# EAGLE design master-v10 (EAGLE 6.5.0)
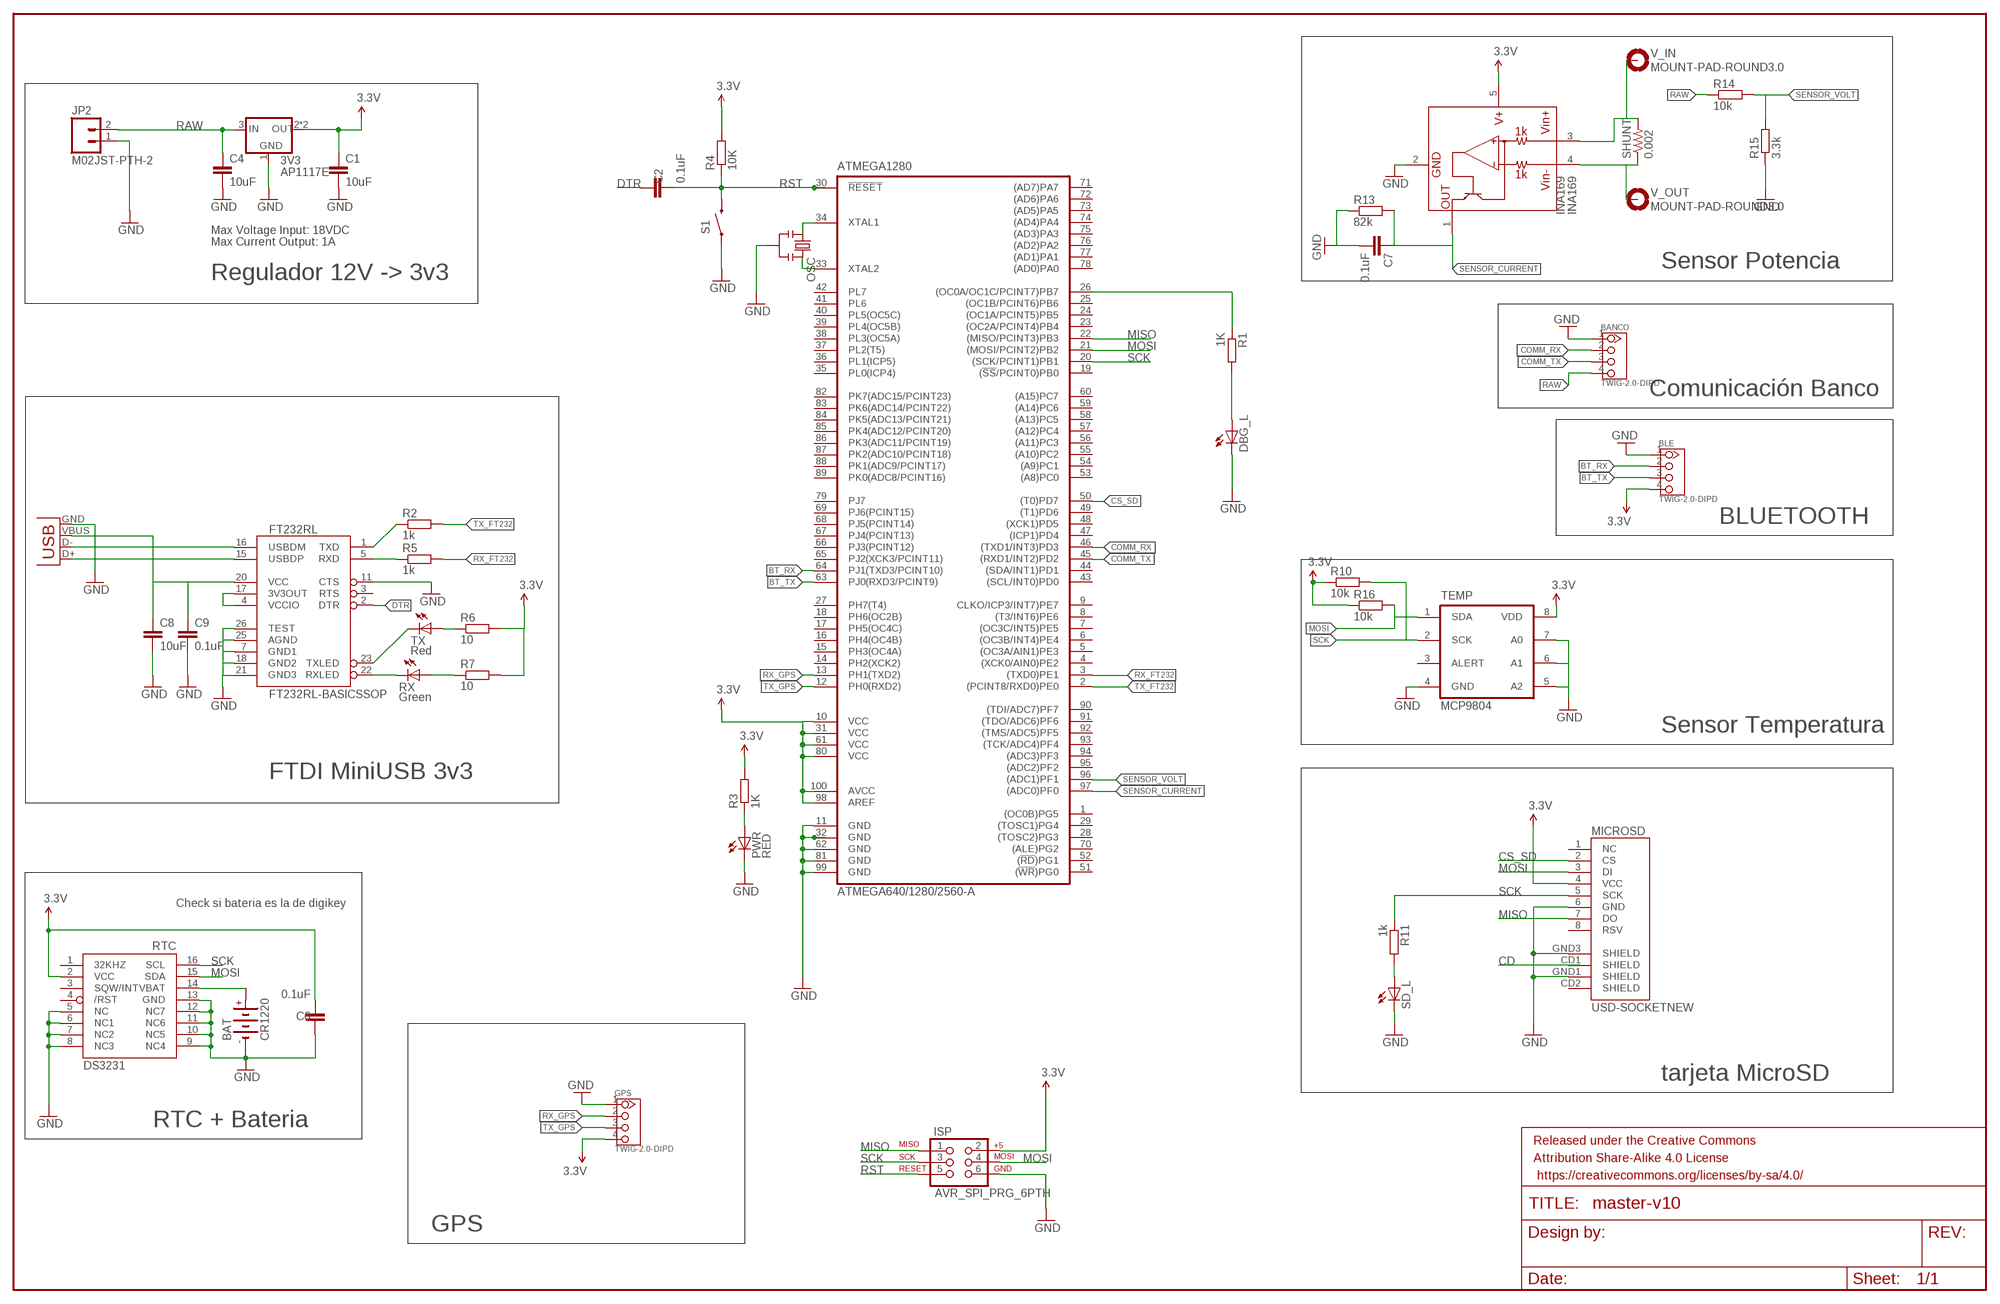
[diagram p0: schematic, sheet 1]

## Parts
3V3  AP1117E  [SOT223]
ATMEGA1280  ATMEGA640/1280/2560-A  [TQFP100A]
BANCO  TWIG-2.0-DIPD  [2.0_1X4_90]
BAT  CR1220  [CR1220]
BLE  TWIG-2.0-DIPD  [2.0_1X4_90]
C1  10uF  C-EUC0805K  [C0805K]
C2  0.1uF  C-EUC0805K  [C0805K]
C4  10uF  C-EUC0805K  [C0805K]
C6  0.1uF  C-EUC0805K  [C0805K]
C7  0.1uF  C-EUC0805K  [C0805K]
C8  10uF  C-EUC1206K  [C1206K]
C9  0.1uF  C-EUC0805K  [C0805K]
DBG_L  LEDCHIPLED_0805  [CHIPLED_0805]
FRAME1  FRAME-LEDGER  [CREATIVE_COMMONS]
FT232RL  FT232RL-BASICSSOP  [SSOP28DB]
GPS  TWIG-2.0-DIPD  [2.0_1X4_90]
INA169  INA169  [SOT23-5]
ISP  AVR_SPI_PRG_6PTH  [2X3]
JP1  USB-MB-H  [USB-MB-H]
JP2  M02JST-PTH-2  [JST-2-PTH]
MICROSD  USD-SOCKETNEW  [MICRO-SD-SOCKET-PP]
OSC  RESONATOR-SMD  [RESONATOR-SMD]
PWR  RED  LEDCHIPLED_0805  [CHIPLED_0805]
R1  1K  R-EU_R0805  [R0805]
R2  1k  R-EU_R0805  [R0805]
R3  1K  R-EU_R0805  [R0805]
R4  10K  R-EU_R0805  [R0805]
R5  1k  R-EU_R0805  [R0805]
R6  10  R-EU_R0805  [R0805]
R7  10  R-EU_R0805  [R0805]
R10  10k  R-EU_R0805  [R0805]
R11  1k  R-EU_R0805  [R0805]
R13  82k  R-EU_R0805  [R0805]
R14  10k  R-EU_R0805  [R0805]
R15  3.3k  R-EU_R0805  [R0805]
R16  10k  R-EU_R0805  [R0805]
RTC  DS3231/SO  [SO16W]
RX  Green  LEDSML0805  [SML0805]
S1  SWITCH-MOMENTARY-2-SMD-1101NE  [TACTILE-SWITCH-1101NE]
SD_L  LEDCHIPLED_0805  [CHIPLED_0805]
SHUNT  0.002  RESISTOR1206  [1206]
TEMP  MCP9804  [MSOP8]
TX  Red  LEDSML0805  [SML0805]
V_IN  MOUNT-PAD-ROUND3.0  [3,0-PAD]
V_OUT  MOUNT-PAD-ROUND3.0  [3,0-PAD]

## Nets
3.3V: 3V3.2(OUT) 3V3.4(OUT) ATMEGA1280.10(VCC) ATMEGA1280.31(VCC) ATMEGA1280.61(VCC) ATMEGA1280.80(VCC) ATMEGA1280.98(AREF) ATMEGA1280.100(AVCC) BLE.4 C1.1 C6.1 GPS.4 INA169.5(V+) ISP.2 MICROSD.4(VCC) R3.2 R4.2 R6.2 R7.2 R10.1 R16.1 RTC.2(VCC) TEMP.8(VDD)
BT_RX: ATMEGA1280.64(PJ1(TXD3/PCINT10)) BLE.2
BT_TX: ATMEGA1280.63(PJ0(RXD3/PCINT9)) BLE.3
COMM_RX: ATMEGA1280.46((TXD1/INT3)PD3) BANCO.2
COMM_TX: ATMEGA1280.45((RXD1/INT2)PD2) BANCO.3
CS_SD: ATMEGA1280.50((T0)PD7) MICROSD.2(CS)
DTR: C2.2 FT232RL.2(DTR)
GND [vcc]: 3V3.1(GND) ATMEGA1280.11(GND) ATMEGA1280.32(GND) ATMEGA1280.62(GND) ATMEGA1280.81(GND) ATMEGA1280.99(GND) BANCO.1 BAT.- BLE.1 C1.2 C4.2 C6.2 C7.2 C8.2 C9.2 DBG_L.C FT232RL.7(GND1) FT232RL.11(CTS) FT232RL.18(GND2) FT232RL.21(GND3) FT232RL.25(AGND) FT232RL.26(TEST) GPS.1 INA169.2(GND) ISP.6 JP1.GND JP2.1 MICROSD.6(GND) MICROSD.GND1(SHIELD) MICROSD.GND3(SHIELD) OSC.2 PWR.C R13.1 R15.1 RTC.5(NC) RTC.6(NC1) RTC.7(NC2) RTC.8(NC3) RTC.9(NC4) RTC.10(NC5) RTC.11(NC6) RTC.12(NC7) RTC.13(GND) S1.P$1 SD_L.C TEMP.4(GND) TEMP.5(A2) TEMP.6(A1) TEMP.7(A0)
MISO: ATMEGA1280.22((MISO/PCINT3)PB3) ISP.1 MICROSD.7(DO)
MOSI: ATMEGA1280.21((MOSI/PCINT2)PB2) ISP.4 MICROSD.3(DI) R16.2 RTC.15(SDA) TEMP.1(SDA)
N$1: BAT.+ RTC.14(VBAT)
N$2: ATMEGA1280.34(XTAL1) OSC.1
N$3: DBG_L.A R1.2
N$4: ATMEGA1280.26((OC0A/OC1C/PCINT7)PB7) R1.1
N$5: FT232RL.15(USBDP) JP1.D+
N$6: FT232RL.1(TXD) R2.1
N$7: PWR.A R3.1
N$8: FT232RL.5(RXD) R5.1
N$10: FT232RL.22(RXLED) RX.C
N$11: R7.1 RX.A
N$12: FT232RL.23(TXLED) TX.C
N$13: R6.1 TX.A
N$14: ATMEGA1280.33(XTAL2) OSC.3
N$19: FT232RL.16(USBDM) JP1.D-
N$23: R11.2 SD_L.A
N$24: C8.1 C9.1 FT232RL.20(VCC) JP1.VBUS
N$25: FT232RL.4(VCCIO) FT232RL.17(3V3OUT)
RAW [vcc]: 3V3.3(IN) BANCO.4 C4.1 JP2.2 R14.1
RST: ATMEGA1280.30(!RESET!) C2.1 ISP.5 R4.1 S1.P$2
RX_FT232: ATMEGA1280.3((TXD0)PE1) R5.2
RX_GPS: ATMEGA1280.13(PH1(TXD2)) GPS.2
SCK: ATMEGA1280.20((SCK/PCINT1)PB1) ISP.3 MICROSD.5(SCK) R10.2 R11.1 RTC.16(SCL) TEMP.2(SCK)
SENSOR_CURRENT: ATMEGA1280.97((ADC0)PF0) C7.1 INA169.1(OUT) R13.2
SENSOR_VOLT: ATMEGA1280.96((ADC1)PF1) R14.2 R15.2
TX_FT232: ATMEGA1280.2((PCINT8/RXD0)PE0) R2.2
TX_GPS: ATMEGA1280.12(PH0(RXD2)) GPS.3
VIN+: INA169.3(VIN+) SHUNT.2 V_IN.B3,0(MOUNT)
VIN-: INA169.4(VIN-) SHUNT.1 V_OUT.B3,0(MOUNT)
Unconnected: ATMEGA1280.1((OC0B)PG5) ATMEGA1280.4((XCK0/AIN0)PE2) ATMEGA1280.5((OC3A/AIN1)PE3) ATMEGA1280.6((OC3B/INT4)PE4) ATMEGA1280.7((OC3C/INT5)PE5) ATMEGA1280.8((T3/INT6)PE6) ATMEGA1280.9(CLKO/ICP3/INT7)PE7) ATMEGA1280.14(PH2(XCK2)) ATMEGA1280.15(PH3(OC4A)) ATMEGA1280.16(PH4(OC4B)) ATMEGA1280.17(PH5(OC4C)) ATMEGA1280.18(PH6(OC2B)) ATMEGA1280.19((!SS!/PCINT0)PB0) ATMEGA1280.23((OC2A/PCINT4)PB4) ATMEGA1280.24((OC1A/PCINT5)PB5) ATMEGA1280.25((OC1B/PCINT6)PB6) ATMEGA1280.27(PH7(T4)) ATMEGA1280.28((TOSC2)PG3) ATMEGA1280.29((TOSC1)PG4) ATMEGA1280.35(PL0(ICP4)) ATMEGA1280.36(PL1(ICP5)) ATMEGA1280.37(PL2(T5)) ATMEGA1280.38(PL3(OC5A)) ATMEGA1280.39(PL4(OC5B)) ATMEGA1280.40(PL5(OC5C)) ATMEGA1280.41(PL6) ATMEGA1280.42(PL7) ATMEGA1280.43((SCL/INT0)PD0) ATMEGA1280.44((SDA/INT1)PD1) ATMEGA1280.47((ICP1)PD4) ATMEGA1280.48((XCK1)PD5) ATMEGA1280.49((T1)PD6) ATMEGA1280.51((!WR!)PG0) ATMEGA1280.52((!RD!)PG1) ATMEGA1280.53((A8)PC0) ATMEGA1280.54((A9)PC1) ATMEGA1280.55((A10)PC2) ATMEGA1280.56((A11)PC3) ATMEGA1280.57((A12)PC4) ATMEGA1280.58((A13)PC5) ATMEGA1280.59((A14)PC6) ATMEGA1280.60((A15)PC7) ATMEGA1280.65(PJ2(XCK3/PCINT11)) ATMEGA1280.66(PJ3(PCINT12)) ATMEGA1280.67(PJ4(PCINT13)) ATMEGA1280.68(PJ5(PCINT14)) ATMEGA1280.69(PJ6(PCINT15)) ATMEGA1280.70((ALE)PG2) ATMEGA1280.71((AD7)PA7) ATMEGA1280.72((AD6)PA6) ATMEGA1280.73((AD5)PA5) ATMEGA1280.74((AD4)PA4) ATMEGA1280.75((AD3)PA3) ATMEGA1280.76((AD2)PA2) ATMEGA1280.77((AD1)PA1) ATMEGA1280.78((AD0)PA0) ATMEGA1280.79(PJ7) ATMEGA1280.82(PK7(ADC15/PCINT23)) ATMEGA1280.83(PK6(ADC14/PCINT22)) ATMEGA1280.84(PK5(ADC13/PCINT21)) ATMEGA1280.85(PK4(ADC12/PCINT20)) ATMEGA1280.86(PK3(ADC11/PCINT19)) ATMEGA1280.87(PK2(ADC10/PCINT18)) ATMEGA1280.88(PK1(ADC9/PCINT17)) ATMEGA1280.89(PK0(ADC8/PCINT16)) ATMEGA1280.90((TDI/ADC7)PF7) ATMEGA1280.91((TDO/ADC6)PF6) ATMEGA1280.92((TMS/ADC5)PF5) ATMEGA1280.93((TCK/ADC4)PF4) ATMEGA1280.94((ADC3)PF3) ATMEGA1280.95((ADC2)PF2) FT232RL.3(RTS) MICROSD.1(NC) MICROSD.8(RSV) MICROSD.CD1(SHIELD) MICROSD.CD2(SHIELD) RTC.1(32KHZ) RTC.3(SQW/INT) RTC.4(/RST) TEMP.3(ALERT)

## Notes on the sheet
- Max Voltage Input: 18VDC
- Max Current Output: 1A
- Sensor Potencia
- Regulador 12V -> 3v3
- Comunicación Banco
- BLUETOOTH
- Sensor Temperatura
- FTDI MiniUSB 3v3
- Check si bateria es la de digikey
- tarjeta MicroSD
- RTC + Bateria
- GPS

## Library data of the parts
3V3 = v-reg:AP1117: LDO Regulator
ATMEGA1280 = atmel-avr:ATMEGA640/1280/2560: MICROCONTROLLER 64K/128K/256K Flash 8K Bytes Internal SRAM 4K Bytes EEPROM
BANCO BLE GPS = Grove :TWIG-2.0-DIP
BAT = battery:CR1220: LI BATTERY Panasonic
C1 C2 C4 C6-C9 = rcl:C-EU: CAPACITOR, European symbol
DBG_L PWR SD_L = adafruit:LED: LED
FRAME1 = SparkFun-Aesthetics:FRAME-LEDGER: Schematic Frame Standard 11x14 US Ledger frame
FT232RL = SparkFun-DigitalIC:FT232RL-BASIC: USB UART This is the simplified version of the FT232RL unit. Only what you need, nothing you don't. Spark Fun Electronics SKU : COM-00650
INA169 = SparkFun-AnalogIC:INA169
ISP = SparkFun-Connectors:AVR_SPI_PRG_6: AVR ISP 6 Pin This is the reduced ISP connector for AVR programming. Common on Arduino. This footprint will take up less PCB space and can be used with a 10-pin to 6-pin adapter such as SKU: BOB-08508
JP1 = SparkFun-Connectors:USB: USB Connectors USB-B-PTH is fully proven SKU : PRT-00139/CONN-08278 USB-miniB is fully proven SKU : PRT-00587 USB-A-PCB is untested. USB-A-H is throughly reviewed, but untested. Spark Fun Electronics SKU : PRT-00437 USB-B-SMT is throughly reviewed, but untested. Needs silkscreen touching up. USB-A-S has not been used/tested USB-MB-H has not been used/tested USB-MICROB has been used. CONN-09505
JP2 = SparkFun-Connectors:M02: Standard 2-pin 0.1" header. Use with - straight break away headers ( PRT-00116) - right angle break away headers (PRT-00553) - swiss pins (PRT-00743) - machine pins (PRT-00117) - female headers (PRT-00115) Molex polarized connector foot print use with: PRT-08233 with associated crimp pins and housings. 2.54_SCREWTERM for use with PRT-10571. 3.5mm Screw Terminal footprints for PRT-08084 5mm Screw Terminal footprints for use with PRT-08433; SKU: PRT-09914
MICROSD = SparkFun-Connectors:USD-SOCKET: microSD Socket Push-push type uSD socket. Schematic element and footprint production proven. Spark Fun Electronics SKU : PRT-00127. tDoc lines correctly indicate media card edge positions when inserting (unlocked, locked, depressed).
OSC = resonador:RESONATOR-: Resonator Small SMD resonator. This is the itty bitty 10/20MHz resonators with built in caps. CSTCE10M0G55 and CSTCE20M0V53. Footprint has been reviewed closely but hasn't been tested yet.
R1-R7 R10 R11 R13-R16 = rcl:R-EU_: RESISTOR, European symbol
RTC = adafruit:DS3231
RX TX = led:LED: LED
S1 = SparkFun-Electromechanical:SWITCH-MOMENTARY-2: Various NO switches- pushbuttons, reed, etc
SHUNT = SparkFun-Resistors:RESISTOR: Resistor Basic schematic elements and footprints for 0603, 1206, and PTH resistors.
TEMP = MCP9804:MCP9804: TEMP SENSOR
V_IN V_OUT = holes:MOUNT-PAD-ROUND: MOUNTING PAD, round

## Net classes
0 default: width 0.178 mm
1 vcc: width 0.203 mm

## Board
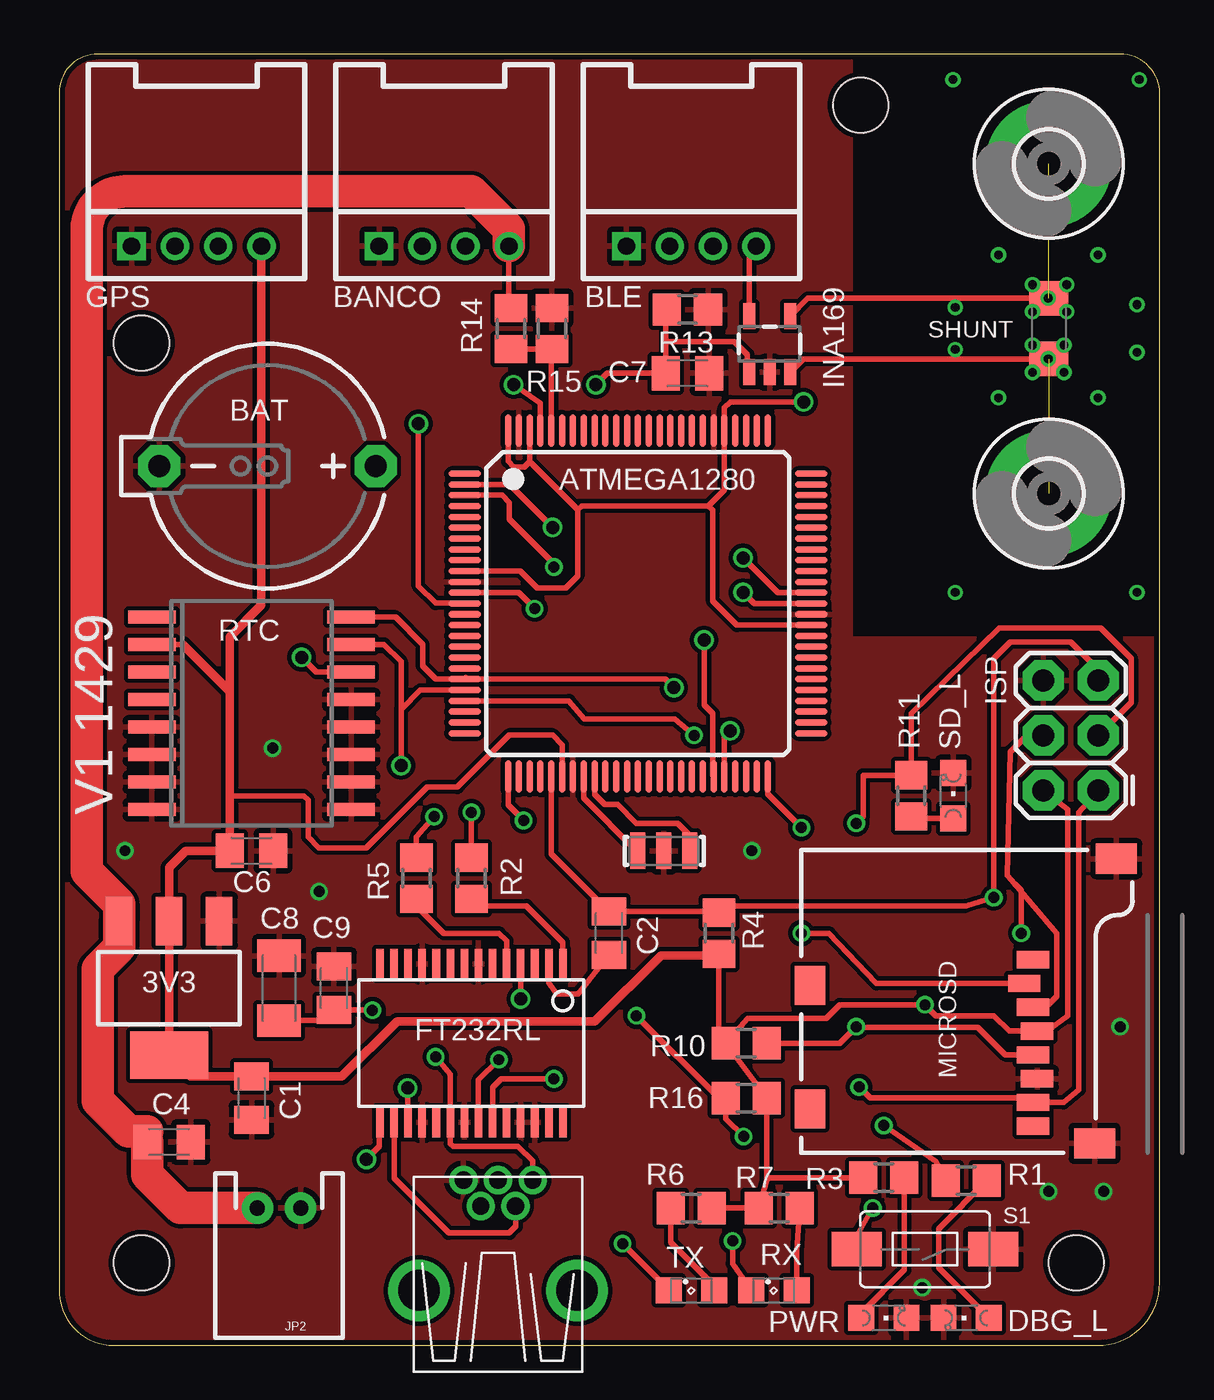
[diagram p1: board, top side]
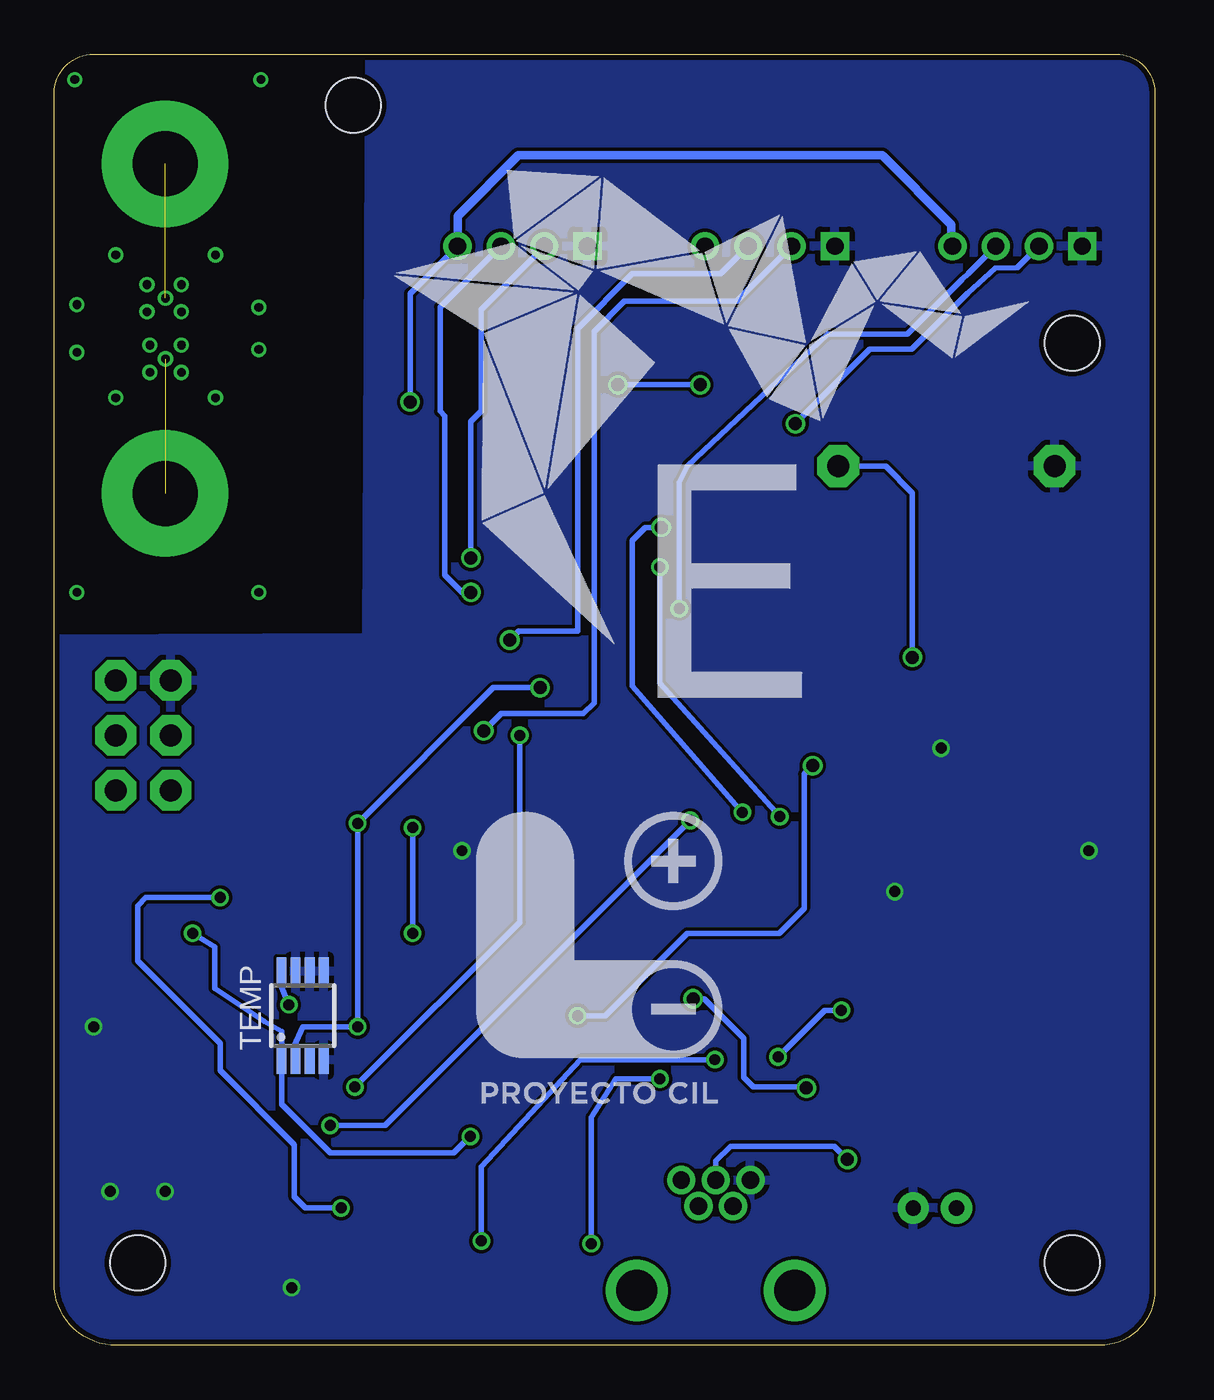
[diagram p2: board, bottom side, seen from below]

Size 50.85 x 59.68 mm. Coordinates in mm from the lower left corner, seen from the top.
Outline: 2.54,0 47.97,0 arc90 50.85,2.89 50.85,57.85 arc90 49.02,59.68 1.79,59.68 arc90 0,57.89 0,2.54 arc90 2.54,0
Copper layers (1*16): Top 0.035mm / dielectric 1.5mm / Bottom 0.035mm
Design rules "ITEADstudio_DRC": minimum track width 6mil, minimum drill 12mil, track to track 6mil, track to pad 6mil, pad to pad 6mil, via to via 6mil, smd to smd 0mil, copper to edge 10mil, drill to drill 10mil, minimum pad ring 10mil, minimum via ring 6mil, stop-mask expansion 2mil, vias tented up to drill 100mil, thermal gap 10mil
Holes 2.54 mm at 3.81,46.32 46.99,3.81 37.03,57.32 3.81,3.81

### Footprints (pad centres in the part's own frame; a part is rotated, then mirrored left to right if it is on the bottom)
SOT223 = smd 1.219 x 2.235: 1 -2.311,-3.099; 2 0,-3.099; 3 2.311,-3.099 | smd 3.6 x 2.2: 4 0,3.099
TQFP100A = smd 1.5 x 0.3: 1 -8,6; 2 -8,5.5; 3 -8,5; 4 -8,4.5; 5 -8,4; 6 -8,3.5; 7 -8,3; 8 -8,2.5; 9 -8,2; 10 -8,1.5; 11 -8,1; 12 -8,0.5; 13 -8,0; 14 -8,-0.5; 15 -8,-1; 16 -8,-1.5; 17 -8,-2; 18 -8,-2.5; 19 -8,-3; 20 -8,-3.5; 21 -8,-4; 22 -8,-4.5; 23 -8,-5; 24 -8,-5.5; 25 -8,-6; 51 8,-6; 52 8,-5.5; 53 8,-5; 54 8,-4.5; 55 8,-4; 56 8,-3.5; 57 8,-3; 58 8,-2.5; 59 8,-2; 60 8,-1.5; 61 8,-1; 62 8,-0.5; 63 8,0; 64 8,0.5; 65 8,1; 66 8,1.5; 67 8,2; 68 8,2.5; 69 8,3; 70 8,3.5; 71 8,4; 72 8,4.5; 73 8,5; 74 8,5.5; 75 8,6 | smd 0.3 x 1.5: 26 -6,-8; 27 -5.5,-8; 28 -5,-8; 29 -4.5,-8; 30 -4,-8; 31 -3.5,-8; 32 -3,-8; 33 -2.5,-8; 34 -2,-8; 35 -1.5,-8; 36 -1,-8; 37 -0.5,-8; 38 0,-8; 39 0.5,-8; 40 1,-8; 41 1.5,-8; 42 2,-8; 43 2.5,-8; 44 3,-8; 45 3.5,-8; 46 4,-8; 47 4.5,-8; 48 5,-8; 49 5.5,-8; 50 6,-8; 76 6,8; 77 5.5,8; 78 5,8; 79 4.5,8; 80 4,8; 81 3.5,8; 82 3,8; 83 2.5,8; 84 2,8; 85 1.5,8; 86 1,8; 87 0.5,8; 88 0,8; 89 -0.5,8; 90 -1,8; 91 -1.5,8; 92 -2,8; 93 -2.5,8; 94 -3,8; 95 -3.5,8; 96 -4,8; 97 -4.5,8; 98 -5,8; 99 -5.5,8; 100 -6,8
2.0_1X4_90 = drill 0.8 pad 1.27 square: 1 -3,0 | drill 0.8 pad 1.27: 2 -1,0; 3 1,0; 4 3,0
CR1220 = drill 1.016 pad 1.93 octagon: + -5,0; - 5,0
C0805K = smd 1.3 x 1.6: 1 -1,0; 2 1,0
C1206K = smd 1.5 x 2: 1 -1.5,0; 2 1.5,0
CHIPLED_0805 = smd 1.2 x 1.2: A 0,-1.05; C 0,1.05
SSOP28DB = smd 0.348 x 1.397: 1 -4.225,-3.656; 2 -3.575,-3.656; 3 -2.925,-3.656; 4 -2.275,-3.656; 5 -1.625,-3.656; 6 -0.975,-3.656; 7 -0.325,-3.656; 8 0.325,-3.656; 9 0.975,-3.656; 10 1.625,-3.656; 11 2.275,-3.656; 12 2.925,-3.656; 13 3.575,-3.656; 14 4.225,-3.656; 15 4.225,3.656; 16 3.575,3.656; 17 2.925,3.656; 18 2.275,3.656; 19 1.625,3.656; 20 0.975,3.656; 21 0.325,3.656; 22 -0.325,3.656; 23 -0.975,3.656; 24 -1.625,3.656; 25 -2.275,3.656; 26 -2.925,3.656; 27 -3.575,3.656; 28 -4.225,3.656
SOT23-5 = smd 0.55 x 1.2: 1 -0.95,-1.3; 2 0,-1.3; 3 0.95,-1.3; 4 0.95,1.3; 5 -0.95,1.3
2X3 = drill 1.016 pad 1.88 octagon: 1 0,0; 2 0,2.54; 3 2.54,0; 4 2.54,2.54; 5 5.08,0; 6 5.08,2.54
USB-MB-H = drill 0.8: D+ 5.1,0; D- 3.9,0.8; GND 5.1,-1.6; ID 3.9,-0.8; VBUS 5.1,1.6 | drill 1.9: P$6 0,-3.65; P$7 0,3.65
JST-2-PTH = drill 0.7 pad 1.448: 1 -1,0; 2 1,0
MICRO-SD-SOCKET-PP = smd 0.8 x 1.5: 1 -8.94,10.7; 2 -7.84,10.3; 3 -6.74,10.7; 4 -5.64,10.9; 5 -4.54,10.7; 6 -3.44,10.9; 7 -2.34,10.7; 8 -1.24,10.7 | smd 1.8 x 1.4: CD1 -2.05,0.4; CD2 -7.75,0.4 | smd 1.4 x 1.9: GND1 -13.6,14.55; GND3 -0.45,13.55
RESONATOR-SMD = smd 0.7 x 1.7: 1 -1.2,0; 2 0,0; 3 1.2,0
R0805 = smd 1.3 x 1.5: 1 -0.95,0; 2 0.95,0
SO16W = smd 0.6 x 2.2: 1 -4.445,-4.6; 2 -3.175,-4.6; 3 -1.905,-4.6; 4 -0.635,-4.6; 5 0.635,-4.6; 6 1.905,-4.6; 7 3.175,-4.6; 8 4.445,-4.6; 9 4.445,4.6; 10 3.175,4.6; 11 1.905,4.6; 12 0.635,4.6; 13 -0.635,4.6; 14 -1.905,4.6; 15 -3.175,4.6; 16 -4.445,4.6
SML0805 = smd 1.2 x 1.2: A 1.05,0; C -1.05,0
TACTILE-SWITCH-1101NE = smd 2.3 x 1.6: P$1 -3.15,0; P$2 3.15,0
1206 = smd 1.6 x 1.8: 1 -1.4,0; 2 1.4,0
MSOP8 = smd 0.45 x 1.3: 1 -0.975,-2.05; 2 -0.325,-2.05; 3 0.325,-2.05; 4 0.975,-2.05; 5 0.975,2.05; 6 0.325,2.05; 7 -0.325,2.05; 8 -0.975,2.05
3,0-PAD = drill 3 pad 5.842: B3,0 0,0

### Placement (x,y rotation side)
3V3  5.08,16.51 180 top
ATMEGA1280  26.74,34.29 0 top
BANCO  17.78,50.8 0 top
BAT  9.63,40.64 180 top
BLE  29.21,50.8 0 top
C1  8.89,11.43 270 top
C2  25.4,19.05 270 top
C4  5.08,9.4 0 top
C6  8.89,22.86 0 top
C7  29.03,44.93 0 top
C8  10.16,16.51 90 top
C9  12.7,16.51 90 top
DBG_L  41.91,1.27 90 top
FRAME1  7.62,-12.7 0 top  (outside the outline)
FT232RL  19.05,13.97 180 top
GPS  6.35,50.8 0 top
INA169  32.83,46.28 0 top
ISP  48.01,25.65 90 top
JP1  20.28,2.54 90 bottom
JP2  10.16,6.35 180 top
MICROSD  34.29,8.89 270 top
OSC  27.94,22.86 180 top
PWR  38.1,1.27 270 top
R1  41.91,7.62 0 top
R2  19.05,21.59 90 top
R3  38.1,7.75 180 top
R4  30.48,19.05 270 top
R5  16.51,21.59 90 top
R6  29.21,6.35 0 top
R7  33.27,6.35 180 top
R10  31.75,13.97 0 top
R11  39.37,25.4 270 top
R13  29.03,47.87 180 top
R14  20.88,46.99 270 top
R15  22.76,46.99 270 top
R16  31.75,11.43 180 top
RTC  8.89,29.21 270 top
RX  33.02,2.54 0 top
S1  40.01,4.45 180 top
SD_L  41.31,25.4 0 top
SHUNT  45.72,46.99 270 top
TEMP  39.37,15.24 0 bottom
TX  29.21,2.54 0 top
U$1  [LOGO_CIL]  33.27,10.29 0 bottom
U$2  [LOGO_ELIBATT]  35.56,26.67 0 bottom
V_IN  45.72,39.37 0 top
V_OUT  45.72,54.61 0 top

### Tracks (layer width: path | path; a pad name or v marks a point on that pad's centre or on a via)
3.3V  (via drill 0.51, 0.6)
  Top 0.254: 6.06,12.43 3V3.4 | R6.2 R7.2 32.7,7.62 | 32.7,7.62 R16.1 R10.1 | 5.08,20.05 3V3.2 | ISP.2 46.61,24.77 46.61,15.24 45.65,14.53 MICROSD.4 43.89,14.53 43.18,15.24 40.51,15.24 v40.01,15.75 | 39.95,15.8 v40.01,15.75 | R10.1 31.82,15.11 35.43,15.11 36.07,15.75 v40.01,15.75 | R10.1 30.48,14.67 30.48,17.65 30.54,18.1 R4.2 30.41,18.03 | ATMEGA1280.10 21.31,35.79 22.1,35 23.4,35 23.96,35.56 23.96,38.62 | 5.71,32.38 RTC.2 | ATMEGA1280.100 20.74,40.86 21,40.6 21.5,40.6 21.74,40.84 | 21.74,40.84 ATMEGA1280.98 | 21.74,40.84 23.96,38.62 | BLE.4 31.88,50.47 INA169.5 | v34.4,43.6 31,43.6 30.74,43.34 ATMEGA1280.80 30.74,39.54 30,38.8 | 30,38.8 24.14,38.8 23.96,38.62 | ATMEGA1280.61 31.31,33.29 30.2,34.4 30.2,38.6 30,38.8 | ATMEGA1280.31 23.24,27.76 22.8,28.2 20.8,28.2 18.4,25.8 17,25.8 14.2,23 12,23 11.5,23.5 11.5,25.2 11.3,25.4 7.89,25.4 | R3.2 32.83,7.75 32.7,7.62
  Top 0.4: 6.06,12.43 C1.1 13.06,12.43 15.62,14.99 24.18,14.97 24.75,14.97 27.81,18.03 30.41,18.03 | 7.89,30.21 7.89,25.4 C6.1 5.84,22.86 5.08,22.1 3V3.2 3V3.4 | 7.89,30.21 5.71,32.38 | 7.89,30.21 7.89,32.75 9.35,34.21 GPS.4
  Bottom 0.254: v40.01,15.75 40.34,16.55 TEMP.8 | v34.4,43.6 34.4,48.61 BLE.4
  Bottom 0.4: GPS.4 9.4,50.85 9.4,51.8 12.6,55 29.4,55 32.21,52.19 BLE.4
BT_RX  (via drill 0.6)
  Top 0.254: 34.54,34.79 ATMEGA1280.64 33.21,34.79 v31.6,36.4
  Bottom 0.254: BLE.2 28.21,50.78 31.11,47.88 31.11,43.18 31.6,42.7 v31.6,36.4
BT_TX  (via drill 0.6)
  Top 0.254: v31.6,34.8 32.11,34.29 ATMEGA1280.63
  Bottom 0.254: BLE.3 33.02,47.99 33.02,43.18 32.8,42.96 32.8,35.6 32,34.8 v31.6,34.8
COMM_RX  (via drill 0.6)
  Top 0.254: v31,28.4 30.74,28.14 ATMEGA1280.46
  Bottom 0.254: BANCO.2 19.32,48.26 24.51,48.26 25.91,46.86 25.91,29.69 26.4,29.2 30.2,29.2 v31,28.4
COMM_TX  (via drill 0.6)
  Top 0.254: v29.8,32.6 29.8,29.6 30.2,29.2 30.2,26.33 ATMEGA1280.45
  Bottom 0.254: BANCO.3 20.05,49.53 24.13,49.53 26.67,46.99 26.67,33.02 29.38,33.02 v29.8,32.6
CS_SD  (via drill 0.51)
  Top 0.254: MICROSD.2 37.75,16.73 35.56,19.05 v34.29,19.05 | v34.29,23.93 32.74,25.48 ATMEGA1280.50
  Bottom 0.254: v34.29,19.05 v34.29,23.93
DTR
  Top 0.254: FT232RL.2 22.62,16.75 22.99,16.26 23.99,16.26 C2.2
GND  (via drill 0.5, 0.51)
  other vias: 9.87,27.6 3.05,22.86 12.01,20.97 32,22.86 39.88,2.67 45.72,7.11 48.26,7.11 49.02,14.73
  pour Bottom: 48.41,0.25 2.95,-0.14 arc-90 -0.13,2.91 -0.13,57.34 arc-90 2.35,59.7 36.3,59.51 36.42,32.71 50.8,32.64 50.67,1.88 arc-90
  pour Top (isolate 0.2): 50.8,32.64 50.8,1.8 arc-90 49,0 2.54,0 arc-90 0,2.54 0,57.59 arc-90 2.1,59.69 36.55,59.69 36.55,32.64
MISO  (via drill 0.51)
  Top 0.254: ISP.1 47.12,24.64 47.12,11.81 46.41,11.23 45.72,11.23 | 45.72,11.23 MICROSD.7 | 45.72,11.23 45.52,11.43 37.47,11.43 v36.96,11.94 | ATMEGA1280.22 23.55,29.79 24.26,28.96 28.45,28.96 v29.34,28.19
  Bottom 0.254: v36.96,11.94 29.34,19.56 v29.34,28.19
MOSI  (via drill 0.51, 0.6)
  Top 0.254: ATMEGA1280.21 19.05,30.29 | ATMEGA1280.21 | ISP.4 44.7,28.19 43.94,27.43 43.81,21.72 44.15,21.33 | 44.15,21.33 46.1,19.05 46.1,16.13 45.71,15.76 MICROSD.3 | v31.62,9.65 30.8,10.47 R16.2 30.48,11.43 v26.67,15.24 | v44.45,19.05 44.45,21.03 44.15,21.33 | v15.8,26.8 15.8,29.4 | 15.8,29.4 16.69,30.29 ATMEGA1280.21 | RTC.15 13.51,32.4 15,32.4 15.8,31.6 15.8,29.4
  Bottom 0.254: v31.62,9.65 32.38,8.89 38.1,8.89 40.34,11.13 TEMP.1 40.34,14.52 41.15,14.99 43.43,16.51 43.43,18.41 v44.45,19.05 | v26.67,15.24 25.4,15.24 21.59,19.05 17.35,19.05 16.2,20.2 16.2,26.4 v15.8,26.8
N$1  (via drill 0.6)
  Top 0.254: v11.2,31.8 11.88,31.11 RTC.14
  Bottom 0.254: BAT.+ 12.44,40.64 11.2,39.4 v11.2,31.8
N$2
  Top 0.254: OSC.1 29.14,23.57 28.57,24.13 26.67,24.13 25.8,25 25.2,25 24.74,25.46 ATMEGA1280.34
N$3
  Top 0.254: R1.2 40.64,5.4 40.64,3.59 DBG_L.A
N$4  (via drill 0.51)
  Top 0.254: R1.1 40.77,8.07 40.51,8.51 v38.1,10.16 | ATMEGA1280.26 20.74,24.98 v21.46,24.26
  Bottom 0.254: v21.46,24.26 35.56,10.16 v38.1,10.16
N$5  (via drill 0.6)
  Top 0.254: FT232RL.15 14.8,10.29 14.8,9.2 v14.2,8.6
  Bottom 0.254: v14.2,8.6 14.8,9.2 19.6,9.2 20.28,8.52 JP1.D+
N$6
  Top 0.254: R2.1 19.05,20.32 21.59,20.32 23.27,18.64 FT232RL.1
N$7
  Top 0.254: R3.1 39.05,3.49 37.05,1.49 PWR.A
N$8
  Top 0.254: FT232RL.5 20.68,18.7 20.32,19.05 17.78,19.05 16.51,20.32 R5.1
N$10  (via drill 0.51)
  Top 0.254: FT232RL.22 19.38,12.26 v20.32,13.21 | v31.11,4.83 31.11,3.78 RX.C
  Bottom 0.254: v20.32,13.21 26.54,13.21 31.11,8.26 v31.11,4.83
N$11
  Top 0.254: R7.1 34.07,4.35 RX.A
N$12  (via drill 0.51)
  Top 0.254: FT232RL.23 20.02,11.93 20.42,12.32 v22.86,12.32 | v26.04,4.7 27.94,2.79 27.94,2.76 TX.C
  Bottom 0.254: v22.86,12.32 24.89,12.32 26.04,10.54 v26.04,4.7
N$13
  Top 0.254: R6.1 28.26,4.76 30.26,2.76 TX.A
N$14
  Top 0.254: OSC.3 26.67,22.86 24.24,25.29 ATMEGA1280.33
N$15  (via drill 0.4 pad 0.3)
  other vias: 44.97,49.03
N$16  (via drill 0.4)
  other vias: 46.55,49.03
N$17  (via drill 0.4)
  other vias: 44.97,47.77
N$18  (via drill 0.4)
  other vias: 46.55,47.77
N$19
  Top 0.254: JP1.D- 21.1,6.42 21.1,5.5 20.8,5.2 18,5.2 15.47,7.72 FT232RL.16
N$20  (via drill 0.4)
  other vias: 45.7,48.4
N$21  (via drill 0.4)
  other vias: 44.97,44.97
N$22  (via drill 0.4)
  other vias: 46.43,44.97
N$23
  Top 0.254: SD_L.A 39.47,24.35 R11.2
N$24  (via drill 0.51)
  Top 0.254: 13.35,15.88 C9.1 | C9.1 12.2,15.01 C8.1 | v17.4,13.34 18.07,12.53 FT232RL.20 18.07,9.32 18.2,9.2 21.2,9.2 21.88,8.52 JP1.VBUS | v14.48,15.49 14.46,15.51 C9.1
  Bottom 0.254: v14.48,15.49 15.24,15.49 v17.4,13.34
N$25  (via drill 0.6)
  Top 0.254: FT232RL.17 16.1,10.34 v16.1,11.9 | v21.32,16.01 FT232RL.4
  Bottom 0.254: v16.1,11.9 16.14,11.94 18.54,11.94 19,12.4 19,14.2 20.81,16.01 v21.32,16.01
N$26  (via drill 0.4)
  other vias: 44.97,46.23
N$27  (via drill 0.4)
  other vias: 46.43,46.23
N$28  (via drill 0.4)
  other vias: 45.7,45.6
N$29  (via drill 0.4)
  other vias: 43.4,50.4
N$30  (via drill 0.4)
  other vias: 48,50.4
N$31  (via drill 0.4)
  other vias: 43.4,43.8
N$32  (via drill 0.4)
  other vias: 48,43.8
N$33  (via drill 0.4)
  other vias: 41.4,34.8
N$34  (via drill 0.4)
  other vias: 49.8,34.8
N$35  (via drill 0.4)
  other vias: 41.3,58.5
N$36  (via drill 0.4)
  other vias: 49.9,58.5
N$37  (via drill 0.4)
  other vias: 49.8,48.1
N$38  (via drill 0.4)
  other vias: 41.4,47.97
N$39  (via drill 0.4)
  other vias: 49.8,45.9
N$40  (via drill 0.4)
  other vias: 41.4,46.03
RAW
  Top 0.254: C4.1 4.08,9.89 | 2.54,19.38 3V3.3 | BANCO.4 20.78,48.04 R14.1
  Top 1.5: JP2.2 5.6,6.35 4.08,7.87 C4.1 | BANCO.4 20.78,51.61 19.05,53.34 3.07,53.34 arc90 1.27,51.54 1.27,21.91 2.77,20.41 2.77,20.2 3V3.3 2.77,18.39 1.78,17.4 1.78,11.3 3.19,9.89 4.08,9.89
RST  (via drill 0.51)
  Top 0.254: ISP.5 48.01,31.24 46.74,32.51 43.94,32.51 43.18,31.75 v43.18,20.7 41.91,20.32 30.48,20.32 R4.1 30.43,20.05 C2.1 22.74,22.71 ATMEGA1280.30 | S1.P$2 36.85,5.05 v37.59,6.35
  Bottom 0.254: v37.59,6.35 39.24,6.35 39.75,6.86 39.75,9.27 43.18,12.7 43.18,13.97 46.99,17.78 46.99,20.32 46.61,20.7 v43.18,20.7
RX_FT232  (via drill 0.51)
  Top 0.254: R5.2 16.51,23.5 v17.33,24.44 | ATMEGA1280.3 20.47,39.29 20.8,38.96 20.8,38.2 22.86,36.14 v22.86,35.97
  Bottom 0.254: v22.86,35.97 22.86,30.61 v17.33,24.44
RX_GPS  (via drill 0.6)
  Top 0.254: 18.8,34.29 ATMEGA1280.13 17.4,34.3 16.6,35.1 v16.6,42.6
  Bottom 0.254: GPS.2 6.35,49.8 7.37,49.78 8.65,48.62 11.24,46.04 13.16,46.04 v16.6,42.6
SCK  (via drill 0.51, 0.6)
  Top 0.254: 18.8,30.86 18.87,30.79 ATMEGA1280.20 | v36.83,24.13 37.15,24.45 37.15,26.35 R11.1 39.37,29.21 43.43,33.15 48.13,33.15 49.53,31.75 49.53,29.72 ISP.3 | R10.2 36.07,13.97 v36.83,14.73 36.7,14.7 42.45,14.7 43.72,13.43 MICROSD.5 | ATMEGA1280.20 28.01,30.79 v28.4,30.4 | ATMEGA1280.20 17.4,30.8 16.8,31.4 16.8,32.4 15.54,33.66 RTC.16
  Bottom 0.254: TEMP.2 39.75,13.13 39.75,13.84 39.37,14.73 v36.83,14.73 v36.83,24.13 30.56,30.4 v28.4,30.4
SENSOR_CURRENT  (via drill 0.6)
  Top 0.254: v24.8,44.4 25.33,44.93 C7.1 28.03,46.4 | v21,44.4 22.24,43.56 ATMEGA1280.97 | R13.2 28.03,47.42 28.03,46.4 | INA169.1 31.8,45.06 31.8,45.8 31.2,46.4 28.03,46.4
  Bottom 0.254: v24.8,44.4 v21,44.4
SENSOR_VOLT
  Top 0.254: ATMEGA1280.96 22.74,46.02 R15.2 R14.2
TX_FT232  (via drill 0.51, 0.6)
  Top 0.254: R2.2 v19.05,24.64 | ATMEGA1280.2 20.81,39.79 v22.8,37.8
  Bottom 0.254: v19.05,24.64 24.13,30.48 24.13,37.2 23.53,37.8 v22.8,37.8
TX_GPS  (via drill 0.51)
  Top 0.254: v21.97,34.05 21.23,34.79 ATMEGA1280.12
  Bottom 0.254: GPS.3 8.62,49.53 8.89,49.28 11.43,46.74 15.11,46.74 21.59,40.64 21.97,39.88 v21.97,34.05
VIN+  (1 unrouted)
  Top 0.254: 45.59,45.72 SHUNT.2 34.39,45.59 INA169.3
VIN-  (1 unrouted)
  Top 0.254: 45.59,48.26 SHUNT.1 34.59,48.39 INA169.4

### Text on the board
tNames: V1 1429